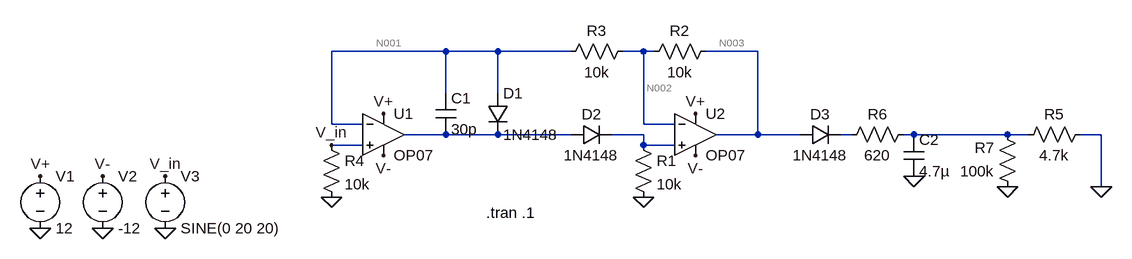
[diagram p0: schematic Peak detector for TIfPO.asc]
Peak detector for TIfPO.asc, the LTspice schematic file:
Version 4
SHEET 1 1428 680
WIRE 400 -16 224 -16
WIRE 480 -16 400 -16
WIRE 592 -16 480 -16
WIRE 704 -16 672 -16
WIRE 720 -16 704 -16
WIRE 880 -16 800 -16
WIRE 400 48 400 -16
WIRE 480 48 480 -16
WIRE 224 96 224 -16
WIRE 272 96 224 96
WIRE 704 96 704 -16
WIRE 752 96 704 96
WIRE 400 112 336 112
WIRE 480 112 400 112
WIRE 592 112 480 112
WIRE 704 112 656 112
WIRE 880 112 880 -16
WIRE 880 112 816 112
WIRE 944 112 880 112
WIRE 1024 112 1008 112
WIRE 1120 112 1104 112
WIRE 1264 112 1120 112
WIRE 1296 112 1264 112
WIRE 1408 112 1376 112
WIRE 272 128 224 128
WIRE 704 128 704 112
WIRE 752 128 704 128
WIRE 1408 192 1408 112
FLAG -32 256 0
FLAG -128 256 0
FLAG -224 256 0
FLAG 304 80 V+
FLAG -224 176 V+
FLAG -128 176 V-
FLAG 304 144 V-
FLAG 784 144 V-
FLAG 784 80 V+
FLAG 704 208 0
FLAG 224 208 0
FLAG -32 176 V_in
FLAG 224 128 V_in
FLAG 1120 176 0
FLAG 1264 192 0
FLAG 1408 192 0
SYMBOL voltage -224 160 R0
WINDOW 123 0 0 Left 0
WINDOW 39 0 0 Left 0
SYMATTR InstName V1
SYMATTR Value 12
SYMBOL voltage -128 160 R0
WINDOW 123 0 0 Left 0
WINDOW 39 0 0 Left 0
SYMATTR InstName V2
SYMATTR Value -12
SYMBOL voltage -32 160 R0
WINDOW 123 0 0 Left 0
WINDOW 39 0 0 Left 0
SYMATTR InstName V3
SYMATTR Value SINE(0 20 20)
SYMBOL Opamps\\OP07 304 48 R0
SYMATTR InstName U1
SYMBOL Opamps\\OP07 784 48 R0
SYMATTR InstName U2
SYMBOL cap 384 48 R0
SYMATTR InstName C1
SYMATTR Value 30p
SYMBOL diode 464 48 R0
SYMATTR InstName D1
SYMATTR Value 1N4148
SYMBOL diode 592 128 R270
WINDOW 0 32 32 VTop 2
WINDOW 3 0 32 VBottom 2
SYMATTR InstName D2
SYMATTR Value 1N4148
SYMBOL res 688 112 R0
SYMATTR InstName R1
SYMATTR Value 10k
SYMBOL res 816 -32 R90
WINDOW 0 0 56 VBottom 2
WINDOW 3 32 56 VTop 2
SYMATTR InstName R2
SYMATTR Value 10k
SYMBOL res 688 -32 R90
WINDOW 0 0 56 VBottom 2
WINDOW 3 32 56 VTop 2
SYMATTR InstName R3
SYMATTR Value 10k
SYMBOL res 208 112 R0
SYMATTR InstName R4
SYMATTR Value 10k
SYMBOL diode 944 128 R270
WINDOW 0 32 32 VTop 2
WINDOW 3 0 32 VBottom 2
SYMATTR InstName D3
SYMATTR Value 1N4148
SYMBOL cap 1104 112 R0
SYMATTR InstName C2
SYMATTR Value 4.7µ
SYMBOL res 1120 96 R90
WINDOW 0 0 56 VBottom 2
WINDOW 3 32 56 VTop 2
SYMATTR InstName R6
SYMATTR Value 620
SYMBOL res 1280 208 R180
WINDOW 0 36 76 Left 2
WINDOW 3 36 40 Left 2
SYMATTR InstName R7
SYMATTR Value 100k
SYMBOL res 1280 128 R270
WINDOW 0 32 56 VTop 2
WINDOW 3 0 56 VBottom 2
SYMATTR InstName R5
SYMATTR Value 4.7k
TEXT 462 232 Left 2 !.tran .1

The netlist it stands for:
* Peak detector for TIfPO.asc
V1 V+ 0 12
V2 V- 0 -12
V3 V_in 0 SINE(0 20 20)
XU1 V_in N001 V+ V- N004 LT1001  ; OP07, pins In+ In- V+ V- OUT
XU2 N005 N002 V+ V- N003 LT1001  ; OP07, pins In+ In- V+ V- OUT
C1 N001 N004 30p
D1 N001 N004 1N4148
D2 N004 N005 1N4148
R1 N005 0 10k
R2 N003 N002 10k
R3 N002 N001 10k
R4 V_in 0 10k
D3 N003 N006 1N4148
C2 N007 0 4.7µ
R6 N007 N006 620
R7 0 N007 100k
R5 N007 0 4.7k
.model D D
.lib standard.dio
.tran .1
.lib LTC.lib
.backanno
.end

* Results of the author's LTspice run, read from the files saved beside the schematic
* Operating Point, zero values left out:
*   V(v+) = 12 V
*   V(v-) = -12 V
*   I(V2) = 4.5 mA
*   I(V1) = -4.5 mA
*   Ix(u1:3) = 2.25 mA
*   Ix(u1:4) = -2.25 mA
*   Ix(u2:3) = 2.25 mA
*   Ix(u2:4) = -2.25 mA
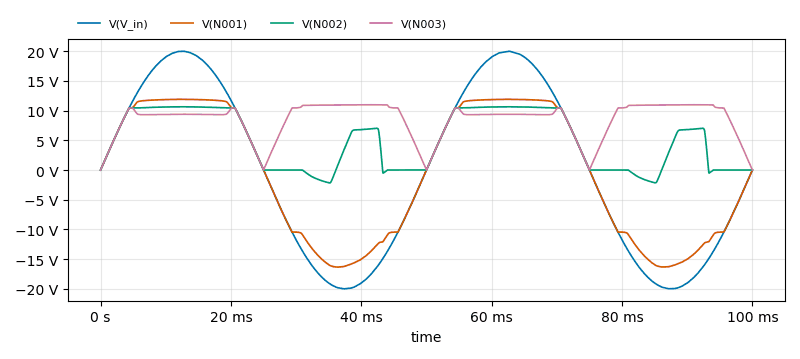
[diagram p1: Transient Analysis of Peak detector for TIfPO.asc, plotted from the saved traces]
* Transient Analysis, 1 run:
*   V(V_in): min -20 V, max 19.99 V, average -1.96 mV, rms 14.14 V, last 0 V
*   V(N001): min -16.34 V, max 11.89 V, average -649.3 mV, rms 10.92 V, last -2.393 mV
*   V(N002): min -2.168 V, max 10.64 V, average 4.998 V, rms 6.923 V, last 795.6 µV
*   V(N003): min -12.85 mV, max 10.98 V, average 8.484 V, rms 9.002 V, last 3.984 mV